# Altium schematic sheet DAC_AFE.SchDoc: Shuttler
size 420 x 297 mm; Author: G.Kasprowicz; CompanyName: WUT ISE; DrawnBy: G.Kasprowicz; Organization: WUT ISE; Address1: PW ISE; Address2: Nowowiejska 15/19 00-665 Warsaw; Address3: gkasprow@gmail.com; DocumentNumber: 4; SheetNumber: 4; SheetTotal: 10; ModifiedBy: -; CheckedDate: -; Title2: DAC AFE; DivGrp: WUT ISE; Designer: G.Kasprowicz; ModifiedDate: -; ProjectName: Sensor Box
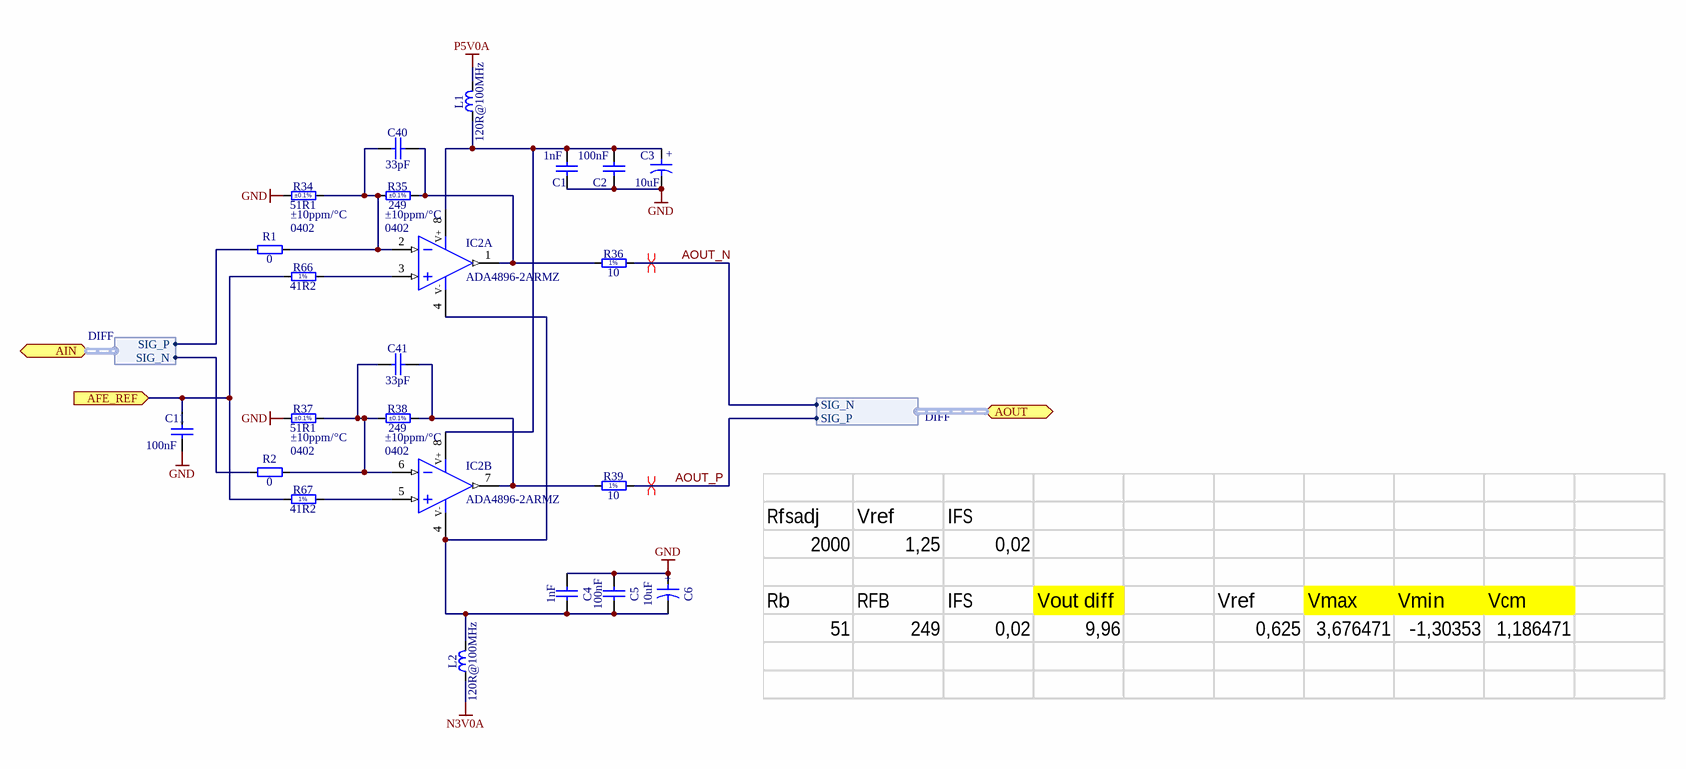
[diagram p0: DAC_AFE.SchDoc]

## Parts
C1  1nF  [CAPC0603X33N]
C2  100nF  [CAPC0603X33N]
C3  10uF  [CAPMP3216X180N]
C4  1nF  [CAPC0603X33N]
C5  100nF  [CAPC0603X33N]
C6  10uF  [CAPMP3216X180N]
C11  100nF  [CAPC0603X33N]
C40  33pF  [CAPC1005X61N]
C41  33pF  [CAPC1005X61N]
IC2  ADA4896-2ARMZ  [SOP65P490X110-8N]  (parts A,B of 2)
L1  120R@100MHz  [INDC1608X95N]
L2  120R@100MHz  [INDC1608X95N]
R1  0  [RESC0603X28N]
R2  0  [RESC0603X28N]
R34  51R1  TC: ±10ppm/°C  Case: 0402  Tolerance: ±0.1%  [RESC1005X35N]
R35  249  TC: ±10ppm/°C  Case: 0402  Tolerance: ±0.1%  [RESC1005X35N]
R36  10  [RESC1005X40N]
R37  51R1  TC: ±10ppm/°C  Case: 0402  Tolerance: ±0.1%  [RESC1005X35N]
R38  249  TC: ±10ppm/°C  Case: 0402  Tolerance: ±0.1%  [RESC1005X35N]
R39  10  [RESC1005X40N]
R66  41R2  [RESC0603X28N]
R67  41R2  [RESC0603X28N]

## Ports
AFE_REF (in), AIN (bidir, harness DIFF), AOUT (bidir, harness DIFF)

## Harnesses
DIFF: SIG_P, SIG_N

## Nets
GND: C1.2 C2.2 C3.2 C4.2 C5.2 C6.1 C11.2 R34.1 R37.1
N3V0A: L2.1
P5V0A: L1.2
AFE_REF: C11.1 R66.1 R67.1 ; port AFE_REF
AOUT_N: R36.2 ; port AOUT.SIG_N
AOUT_P: R39.2 ; port AOUT.SIG_P
NetC1_1: C1.1 C2.1 C3.1 IC2.8(V+) L1.1
NetC4_1: C4.1 C5.1 C6.2 IC2.4(V-) L2.2
NetC40_1: C40.1 IC2.2(IN-) R1.2 R34.2 R35.1
NetC40_2: C40.2 IC2.1(OUT) R35.2 R36.1
NetC41_1: C41.1 IC2.6(IN-) R2.2 R37.2 R38.1
NetC41_2: C41.2 IC2.7(OUT) R38.2 R39.1
NetIC2_3: IC2.3(IN+) R66.2
NetIC2_5: IC2.5(IN+) R67.2
NetR1_1: R1.1 ; port AIN.SIG_P
NetR2_1: R2.1 ; port AIN.SIG_N

## Layout directives
differential pair; differential pair class V_analog: AOUT_N, AOUT_P

## Notes on the sheet
- Project/Equipment
- Document
- Designer
- Drawn by
- Check.by
- Copyright WUT ISE 2018.
  This documentation describes Open Hardware and is licensed under the CERN OHL v.1.1. You may redistribute and modify this documentation under the terms of the CERN OHL v.1.1. (http://ohwr.org/CERNOHL). This documentation is distributed WITHOUT ANY EXPRESS OR IMPLIED WARRANTY, INCLUDING OF MERCHANTABILITY, SATISFACTORY QUALITY AND FITNESS FOR A PARTICULAR PURPOSE. Please see the CERN OHL v.1.1 for applicable conditions.
- Contact
- File
- Last Mod.
- Print Date
- Sheet
- Size
- A3
- of
- Rev
- (in symbol CTE3216-18_10UF_10V_10%_LESR1800) +
- (in symbol R0402_10R_1%_0.0625W_200PPM) 1%
- (in symbol RES_0201_41R2_1%_200ppm) 1%

## Library data of the parts
C1 C4 = CC0201_1NF_16V_10%_X5R: Non-polarised capacitor; Part Description: SMD Multilayer Chip Ceramic Capacitor; Manufacturer: GENERIC; Manufacturer1 Part Number: 0201YD102KAT2A; Voltage: 16V; TC: X5R; Tolerance: ±10%; Part Number: CC0201_1NF_16V_10%_X5R; Component Kind: Standard; Component Type: Standard; Pin Count: 2; Value: 1nF; Status: Not Recommended; Manufacturer Part Number: CC0201_1NF_16V_10%_X5R; Case: 0201; Mounted: Yes; Socket: No; SMD: Yes; Sense: No; Manufacturer1 Example: AVX; Manufacturer1 ComponentHeight: 0.33mm; HelpURL: \\cern.ch\dfs\Applications\Altium\Datasheets\CC0201_X5R_AVX.pdf; Author: CERN DEM JLC; CreateDate: 03.12.2007; LatestRevisionDate: 03.12.2007
C2 C5 C11 = CC0201_100NF_6.3V_10%_X5R: Non-polarised capacitor; Part Description: SMD Multilayer Chip Ceramic Capacitor; Manufacturer: GENERIC; Manufacturer1 Part Number: 02016D104KAT2A; Voltage: 6.3V; TC: X5R; Tolerance: ±10%; Part Number: CC0201_100NF_6.3V_10%_X5R; Component Kind: Standard; Component Type: Standard; Pin Count: 2; Value: 100nF; Status: Not Recommended; Manufacturer Part Number: CC0201_100NF_6.3V_10%_X5R; Case: 0201; Mounted: Yes; Socket: No; SMD: Yes; Sense: No; Manufacturer1 Example: AVX; Manufacturer1 ComponentHeight: 0.33mm; HelpURL: \\cern.ch\dfs\Applications\Altium\Datasheets\CC0201_X5R_AVX.pdf; Author: CERN DEM JLC; CreateDate: 03.12.2007; LatestRevisionDate: 03.12.2007
C3 C6 = CTE3216-18_10UF_10V_10%_LESR1800: Polarised capacitor; Part Description: Low ESR 1R8 Solid Tantalum Chip Capacitor; Manufacturer: GENERIC; Manufacturer1 Part Number: TPSA106K010R1800; Voltage: 10V; Tolerance: ±10%; Part Number: CTE3216-18_10UF_10V_10%_LESR1800; Component Kind: Standard; Component Type: Standard; Pin Count: 2; Value: 10uF; Status: Preferred; Manufacturer Part Number: CTE3216-18_10UF_10V_10%_LESR1800; Case: A; Mounted: Yes; Socket: No; SMD: Yes; Sense: No; Manufacturer1 Example: AVX; Manufacturer1 ComponentHeight: 1.8mm; HelpURL: \\cern.ch\dfs\Applications\Altium\Datasheets\CTE-LESR_AVX_TPS.pdf; Author: CERN DEM JLC; CreateDate: 05.05.2008; LatestRevisionDate: 20.01.2009
C40 C41 = CC0402_33PF_50V_1%_NP0_JOHANSON_R07S: Non-polarised capacitor; Part Description: Ultra High-Q SMD Multilayer Capacitor; Manufacturer: JOHANSON TECHNOLOGY; Manufacturer Part Number: 500R07S330FV4T; Voltage: 50V; TC: C0G/NP0; Tolerance: ±1%; Part Number: CC0402_33PF_50V_1%_NP0_JOHANSON_R07S; Component Kind: Standard; Component Type: Standard; Pin Count: 2; Value: 33pF; Status: Not Recommended; Case: 0402; Mounted: Yes; Socket: No; SMD: Yes; Sense: No; ComponentHeight: 0.61mm; HelpURL: \\cern.ch\dfs\Applications\Altium\Datasheets\CC0402_NP0_JOHANSON_R07S.pdf; Author: CERN DEM BC; CreateDate: 20.11.2017; LatestRevisionDate: 26.09.2018
IC2 = ADA4896-2ARMZ: Dual Operational Amplifier; Part Description: 1 nV/sqrt Hz, Low Power, Rail-to-Rail Output Amplifiers; Manufacturer: ANALOG DEVICES; PressFit: No; Bonding: No; Part Number: ADA4896-2ARMZ; Component Kind: Standard; Component Type: Standard; Device: ADA4896-2ARMZ; PackageDescription: SOP, 0.65mm Pitch; 8 Pin, 3.00mm W X 3.00mm L X 1.10mm H body, IPC Medium Density; Manufacturer Part Number: ADA4896-2ARMZ; Pin Count: 8; Case: MSOP8; Mounted: Yes; Socket: No; SMD: Yes; Sense: No; ComponentHeight: 1.1mm; Author: CERN DEM MR; HelpURL: \\cern.ch\dfs\Applications\Altium\Datasheets\ADA4896-2ARMZ.pdf; CreateDate: 27/04/2016; LatestRevisionDate: 08/11/2017
L1 L2 = IND0603_MURATA_BLM18PG121SN1D: Inductor; Part Description: SMD EMIFIL Chip Ferrite Bead; Manufacturer: MURATA; Power: 2A; Resistance: 0.05R; Part Number: IND0603_MURATA_BLM18PG121SN1D; Component Kind: Standard; Component Type: Standard; Pin Count: 2; Value: 120R@100MHz; Status: None; Manufacturer Part Number: BLM18PG121SN1D; Case: 0603; Mounted: Yes; Socket: No; SMD: Yes; Sense: No; ComponentHeight: 0.95mm; HelpURL: \\cern.ch\dfs\Applications\Altium\Datasheets\IND0603_MURATA_BLM18P.pdf; Author: CERN DEM BC; CreateDate: 27.07.2015; LatestRevisionDate: 27.07.2015
R1 R2 = R0201_0R_JUMPER: Resistor; Part Description: 1A (0.05R Max DC Resistance) Zero Ohm Jumper; Manufacturer: GENERIC; Manufacturer1 Part Number: CRCW02010000Z0ED; PressFit: No; Part Number: R0201_0R_JUMPER; Component Kind: Standard; Component Type: Standard; Pin Count: 2; Value: 0; Status: Not Recommended; Manufacturer Part Number: R0201_0R_JUMPER; Case: 0201; Mounted: Yes; Sense: No; Socket: No; SMD: Yes; Manufacturer1 Example: VISHAY; Manufacturer1 ComponentHeight: 0.27mm; HelpURL: \\cern.ch\dfs\Applications\Altium\Datasheets\R0201_VISHAY_CRCW e3.pdf; Author: CERN DEM JLC; CreateDate: 19.11.2014; LatestRevisionDate: 08.01.2015
R34 R37 = RES_0402_51R1_0.1%_10ppm: Resistor - 0.1%; Part Number: R_0402_51R1_0.1%_10ppm; Part Description: Thin Film Precision Resistor; Manufacturer: GENERIC; Manufacturer1 Part Number: RQ73C1E51R1BTD; Power: 1/16W; PressFit: No; Component Kind: Standard; Component Type: Standard; Pin Count: 2; Value: 51R1; Status: Recommended; Manufacturer Part Number: R_0402_51R1_0.1%_10ppm; Mounted: Yes; Sense: No; Socket: No; SMD: Yes; Manufacturer1 Example: TE CONNECTIVITY; Manufacturer1 ComponentHeight: 0.35mm; HelpURL: \\cern.ch\dfs\Applications\Altium\Datasheets\R0402_TYCO_CPF.pdf; Author: GK; CreateDate: 22.09.2015; LatestRevisionDate: 22.09.2015
R35 R38 = RES_0402_249R_0.1%_10ppm: Resistor - 0.1%; Part Number: R_0402_249R_0.1%_10ppm; Part Description: Thin Film Precision Resistor; Manufacturer: GENERIC; Manufacturer1 Part Number: RQ73C1E249RBTD; Power: 1/16W; PressFit: No; Component Kind: Standard; Component Type: Standard; Pin Count: 2; Value: 249; Status: Recommended; Manufacturer Part Number: R_0402_249R_0.1%_10ppm; Mounted: Yes; Sense: No; Socket: No; SMD: Yes; Manufacturer1 Example: TE CONNECTIVITY; Manufacturer1 ComponentHeight: 0.35mm; HelpURL: \\cern.ch\dfs\Applications\Altium\Datasheets\R0402_TYCO_CPF.pdf; Author: GK; CreateDate: 22.09.2015; LatestRevisionDate: 22.09.2015
R36 R39 = R0402_10R_1%_0.0625W_200PPM: Resistor - 1%; Part Description: General Purpose Thick Film Chip Resistor; Manufacturer: GENERIC; Manufacturer1 Part Number: 232270671009L; TC: ±200ppm/°C; PressFit: No; Part Number: R0402_10R_1%_0.0625W_200PPM; Component Kind: Standard; Component Type: Standard; Pin Count: 2; Value: 10; Status: Not Recommended; Power: 0.0625W; Tolerance: ±1%; Manufacturer Part Number: R0402_10R_1%_0.0625W_200PPM; Case: 0402; Mounted: Yes; Sense: No; Socket: No; SMD: Yes; Manufacturer1 Example: YAGEO PHYCOMP; Manufacturer1 ComponentHeight: 0.4mm; HelpURL: \\cern.ch\dfs\Applications\Altium\Datasheets\R0402_Phycomp_RC0402.pdf; Author: CERN DEM JLC; CreateDate: 24/06/2009; LatestRevisionDate: 17/10/2012
R66 R67 = RES_0201_41R2_1%_200ppm: 41R2k, 0201, 1%; Part Number: R0201_41R2_1%_200ppm; Part Description: Thick Film Chip Resistor; Manufacturer: GENERIC; Manufacturer Part Number: RES0201_41R2_1%_200ppm; Manufacturer1 Part Number: RC0201FR-0741R2L; Power: 0.05W; TC: ±200ppm/°C; Table: Resistors SMD; Component Kind: Standard; Component Type: Standard; Pin Count: 2; Value: 41R2; Status: Not recommended; Tolerance: ±1%; Case: 0201; Mounted: Yes; Socket: No; SMD: Yes; Manufacturer1 Example: Yaego; Manufacturer1 ComponentHeight: 0.27mm; HelpURL: \\cern.ch\dfs\Applications\Altium\Datasheets\R0201_VISHAY_CRCW e3.pdf; Author: GK; CreateDate: 2014-11-13; LatestRevisionDate: 2014-11-13